# EAGLE design Adafruit bicolor 8x8 (EAGLE 6.3)
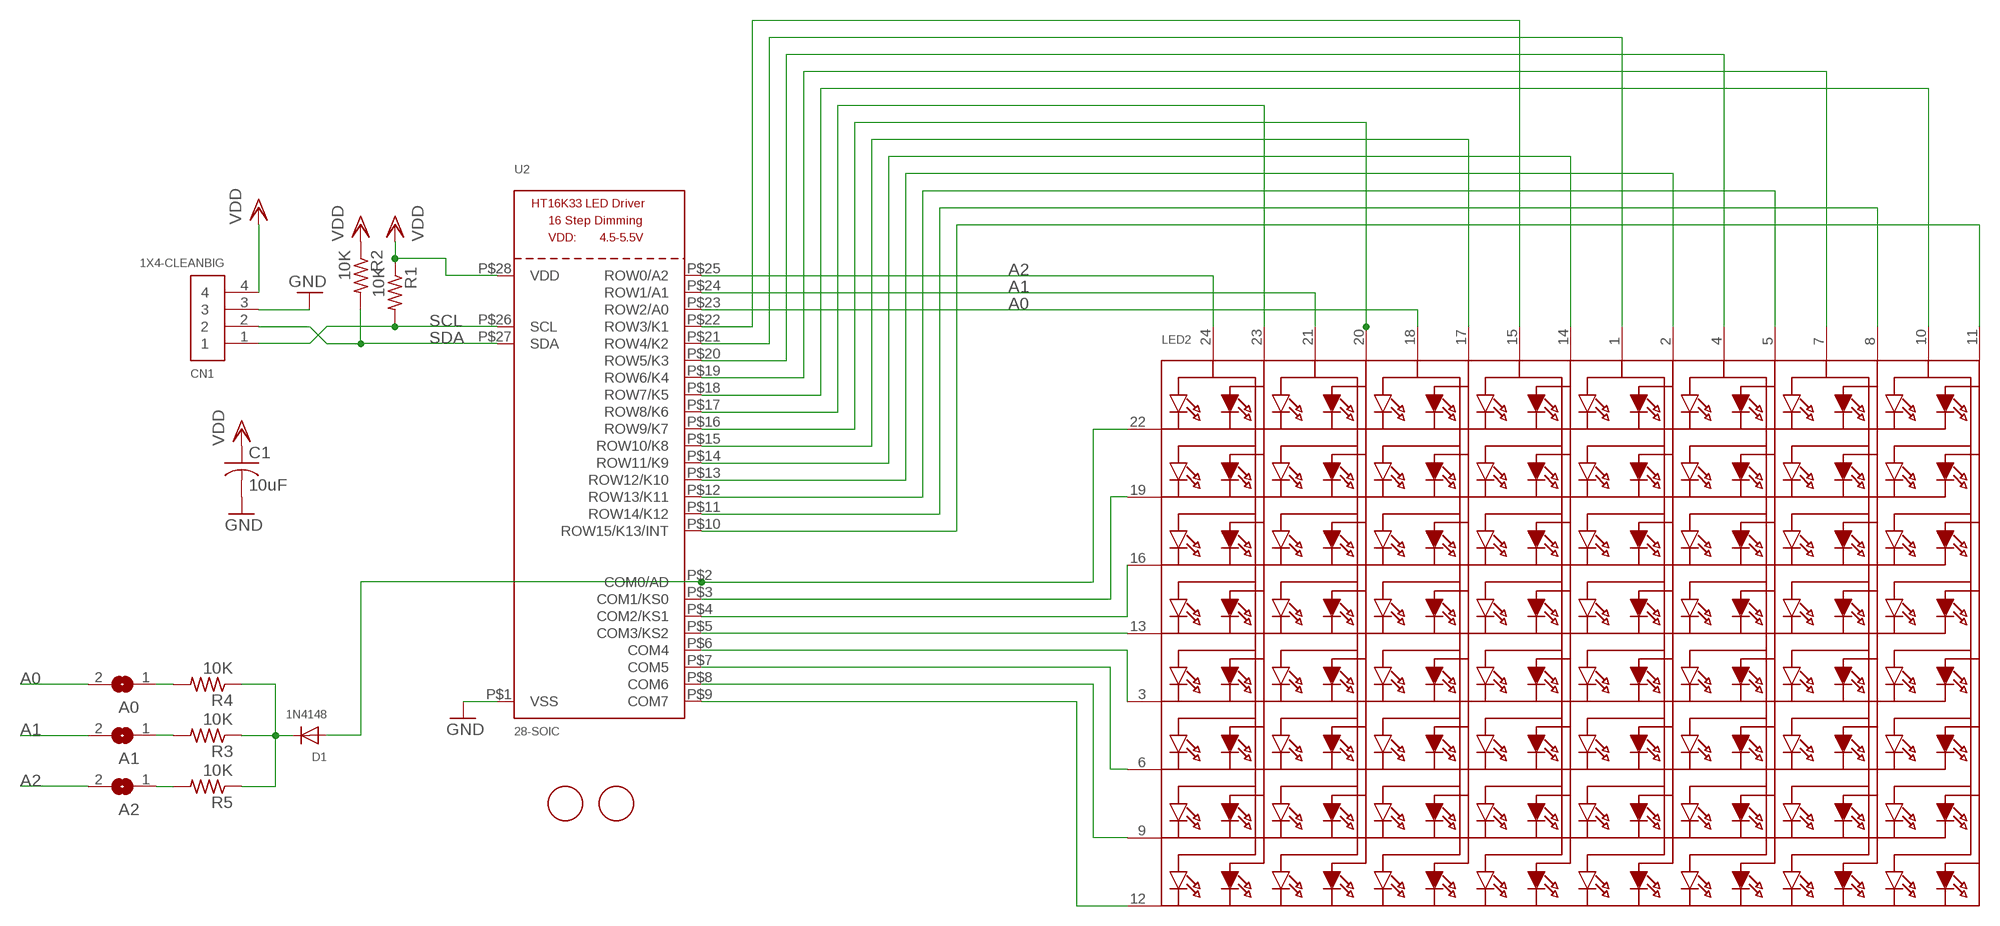
[diagram p0: schematic, sheet 1]

## Parts
A0  SOLDERJUMPERREFLOW_NOPASTE  [SOLDERJUMPER_REFLOW_NOPASTE]
A1  SOLDERJUMPERREFLOW_NOPASTE  [SOLDERJUMPER_REFLOW_NOPASTE]
A2  SOLDERJUMPERREFLOW_NOPASTE  [SOLDERJUMPER_REFLOW_NOPASTE]
C1  10uF  C-USC0805  [C0805]
CN1  1X4-CLEANBIG  [1X04-CLEANBIG]
D1  1N4148  DIODESOD-323F  [SOD-323F]
LED2  DISP_SEGMENT_8X8_BICOLOR_ROWCATHODEMI2A883XX  [SEGMENT_BICOL_BL-M12A883XX]
R1  10K  R-US_R0805  [R0805]
R2  10K  R-US_R0805  [R0805]
R3  10K  R-US_R0805  [R0805]
R4  10K  R-US_R0805  [R0805]
R5  10K  R-US_R0805  [R0805]
U2  28-SOIC  HT16K33_SOP28  [SOP28_300MIL]
U$1  FIDUCIAL  [FIDUCIAL_1MM]
U$2  FIDUCIAL  [FIDUCIAL_1MM]

## Nets
A0: A0.2 LED2.18(A5) U2.P$23(ROW2/A0)
A1: A1.2 LED2.21(A3) U2.P$24(ROW1/A1)
A2: A2.2 LED2.24(A1) U2.P$25(ROW0/A2)
GND: C1.2 CN1.3 U2.P$1(VSS)
N$1: LED2.12(K8) U2.P$9(COM7)
N$2: LED2.9(K7) U2.P$8(COM6)
N$3: LED2.6(K6) U2.P$7(COM5)
N$4: LED2.3(K5) U2.P$6(COM4)
N$5: LED2.13(K4) U2.P$5(COM3/KS2)
N$6: LED2.16(K3) U2.P$4(COM2/KS1)
N$7: LED2.19(K2) U2.P$3(COM1/KS0)
N$8: D1.A LED2.22(K1) U2.P$2(COM0/AD)
N$9: A2.1 R5.2
N$10: LED2.8(A14) U2.P$11(ROW14/K12)
N$11: LED2.5(A12) U2.P$12(ROW13/K11)
N$12: LED2.11(A16) U2.P$10(ROW15/K13/INT)
N$16: D1.C R3.1 R4.1 R5.1
N$19: A1.1 R3.2
N$20: A0.1 R4.2
N$22: LED2.10(A15) U2.P$18(ROW7/K5)
N$23: LED2.7(A13) U2.P$19(ROW6/K4)
N$25: LED2.1(A9) U2.P$21(ROW4/K2)
N$26: LED2.15(A7) U2.P$22(ROW3/K1)
N$35: LED2.4(A11) U2.P$20(ROW5/K3)
N$38: LED2.23(A2) U2.P$17(ROW8/K6)
N$39: LED2.20(A4) U2.P$16(ROW9/K7)
N$40: LED2.14(A8) U2.P$14(ROW11/K9)
N$41: LED2.17(A6) U2.P$15(ROW10/K8)
N$42: LED2.2(A10) U2.P$13(ROW12/K10)
SCL: CN1.1 R1.2 U2.P$26(SCL)
SDA: CN1.2 R2.2 U2.P$27(SDA)
VDD: C1.1 CN1.4 R1.1 R2.1 U2.P$28(VDD)

## Library data of the parts
A0 A1 A2 = microbuilder:SOLDERJUMPER: SMD Solder JUMPER Solder the two pads together to create a connection, or remove the solder to break it. REFLOW - Use this footprint for solder paste and reflow ovens. WAVE - Use this footprint for hand-soldering (larger pads). CLOSED - Has a trace between the two pads to ensure it is closed by default. The trace needs to be cut to disable the jumper, and can be closed again by creating a solder bridge between the two pads.
C1 = rcl:C-US: CAPACITOR, American symbol
CN1 = adafruit:1X4: 4-pin connector
D1 = adafruit:DIODE: Diode SMADIODE - SMA Surface Mount Package 20V 1A Schottky Diode Digikey: 641-1014-6-ND DO-1N4148 - Through Hole Small Current Diode SOD-123 20V 1 A (.5mV Vf) Schottky Diode - Digikey: MBRX120TPMSCT-ND SOD-323 10V 570mA (.38mV Vf, 3ns) Schottky Diode - Digikey: ZLLS410CT-ND SOD-523 30V 30mA Schottky Diode (RB751S-40TE61) - Digikey: RB751S-40TE61CT-ND SOT23-R/W - SOT23 Package (R = Solder Paste/Reflow Ovens, W = Hand-Soldering) BAT54Film 40V 300mA - Digikey: 497-7162-1-ND
LED2 = microbuilder:DISP_SEGMENT_8X8_BICOLOR_ROWCATHODE: 8x8 Bi-Color LED Segment Displays: Row = Cathode 1.2" Bi-Color 8x8 Matrix, 3.0mm Square LEDs - BL-M12A883XX
R1-R5 = adafruit:R-US_: RESISTOR, American symbol
U2 = microbuilder:HT16K33_SOP28
U$1 U$2 = adafruit:FIDUCIAL: For use by pick and place machines to calibrate the vision/machine, 1mm By microbuilder.eu

## Board
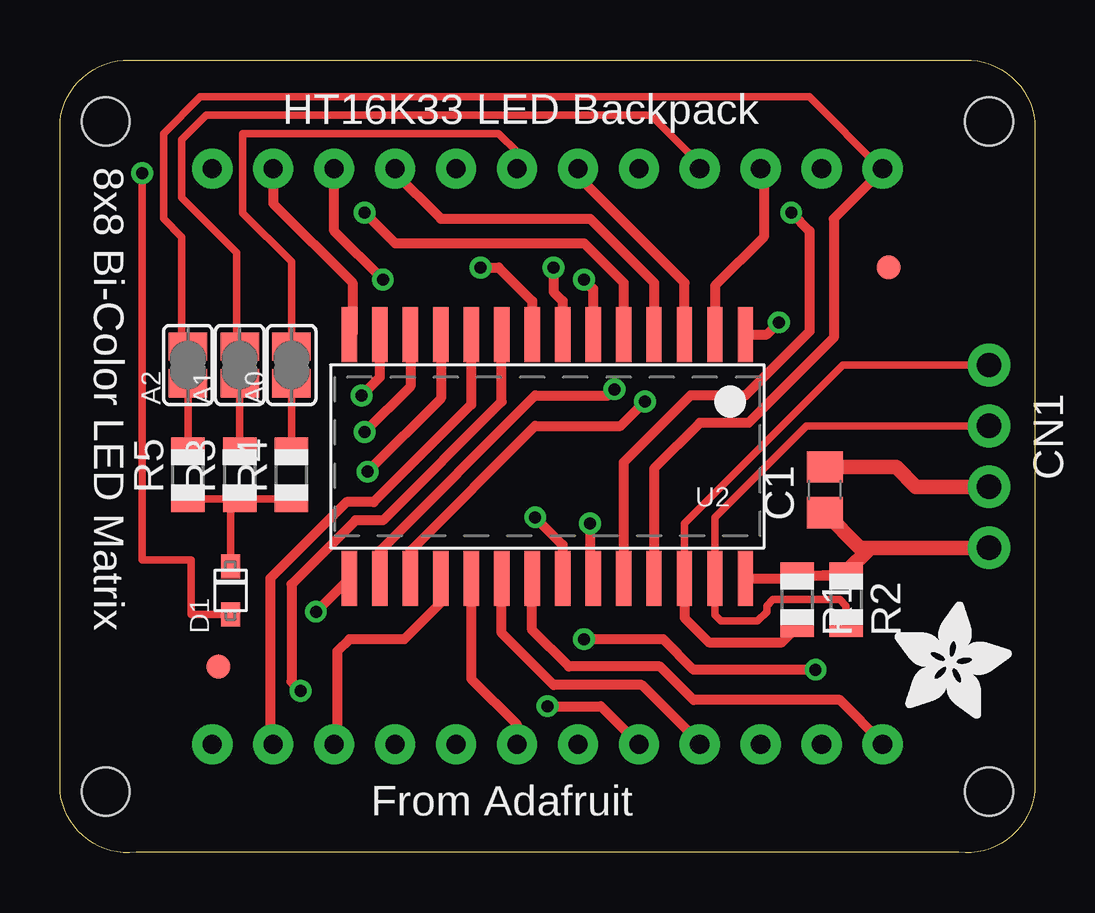
[diagram p1: board, top side]
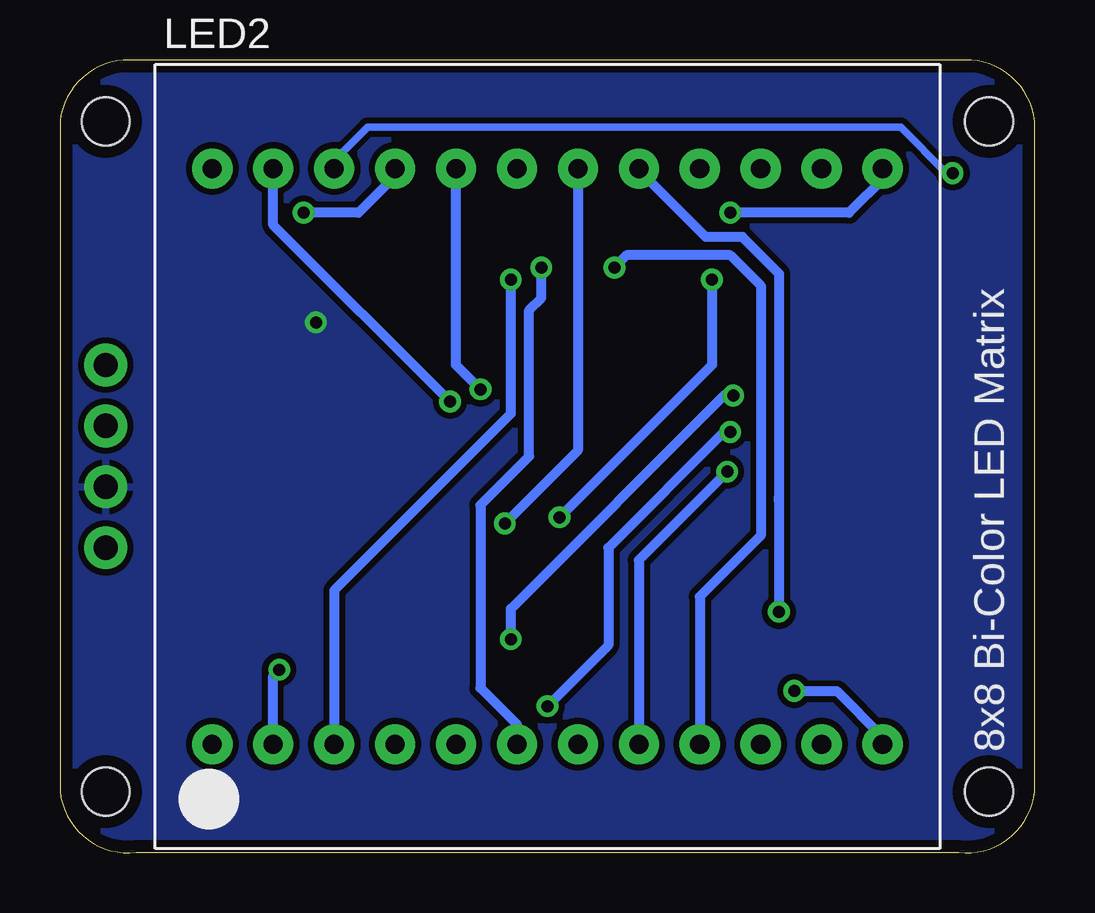
[diagram p2: board, bottom side, seen from below]

Size 40.64 x 33.05 mm. Coordinates in mm from the lower left corner, seen from the top.
Outline: 0,30.5 arc-90 3.18,33.04 37.47,33.04 arc-90 40.64,30.5 40.64,2.56 arc-90 37.47,0.02 3.18,0.02 arc-90 0,2.56 0,30.5
Copper layers (1*16): Top 0.035mm / dielectric 1.5mm / Bottom 0.035mm
Design rules: minimum track width 10mil, minimum drill 19mil, track to track 10mil, track to pad 10mil, pad to pad 10mil, via to via 10mil, smd to smd 8mil, copper to edge 20mil, drill to drill 8mil, minimum pad ring 10mil, minimum via ring 8mil, stop-mask expansion 4mil, vias tented up to drill 20mil, thermal gap 10mil
Holes 2 mm at 1.91,2.56 38.73,2.56 1.91,30.5 38.73,30.5

### Footprints (pad centres in the part's own frame; a part is rotated, then mirrored left to right if it is on the bottom)
SOLDERJUMPER_REFLOW_NOPASTE = smd 1.168 x 1.6: 1 -0.762,0; 2 0.762,0
C0805 = smd 1.3 x 1.5: 1 -0.95,0; 2 0.95,0
1X04-CLEANBIG = drill 1.016 pad 1.778: 1 -3.81,0; 2 -1.27,0; 3 1.27,0; 4 3.81,0
SOD-323F = smd 1 x 0.8: A -1,0; C 1,0
SEGMENT_BICOL_BL-M12A883XX = drill 0.8 pad 1.676: 1 -13.97,-12; 2 -11.43,-12; 3 -8.89,-12; 4 -6.35,-12; 5 -3.81,-12; 6 -1.27,-12; 7 1.27,-12; 8 3.81,-12; 9 6.35,-12; 10 8.89,-12; 11 11.43,-12; 12 13.97,-12; 13 13.97,12; 14 11.43,12; 15 8.89,12; 16 6.35,12; 17 3.81,12; 18 1.27,12; 19 -1.27,12; 20 -3.81,12; 21 -6.35,12; 22 -8.89,12; 23 -11.43,12; 24 -13.97,12
R0805 = smd 1.1 x 1.4: 1 -1,0; 2 1,0
SOP28_300MIL = smd 0.635 x 2.286: P$1 -8.255,-5.08; P$2 -6.985,-5.08; P$3 -5.715,-5.08; P$4 -4.445,-5.08; P$5 -3.175,-5.08; P$6 -1.905,-5.08; P$7 -0.635,-5.08; P$8 0.635,-5.08; P$9 1.905,-5.08; P$10 3.175,-5.08; P$11 4.445,-5.08; P$12 5.715,-5.08; P$13 6.985,-5.08; P$14 8.255,-5.08; P$15 8.255,5.08; P$16 6.985,5.08; P$17 5.715,5.08; P$18 4.445,5.08; P$19 3.175,5.08; P$20 1.905,5.08; P$21 0.635,5.08; P$22 -0.635,5.08; P$23 -1.905,5.08; P$24 -3.175,5.08; P$25 -4.445,5.08; P$26 -5.715,5.08; P$27 -6.985,5.08; P$28 -8.255,5.08
FIDUCIAL_1MM = smd 1 x 1: 1 0,0

### Placement (x,y rotation side)
A0  9.65,20.34 90 top
A1  7.49,20.34 90 top
A2  5.33,20.34 90 top
C1  31.88,15.13 90 top
CN1  38.73,16.53 270 top
D1  7.11,10.94 90 top
LED2  20.32,16.53 0 bottom
R1  30.73,10.56 270 top
R2  32.77,10.56 270 top
R3  7.49,15.77 90 top
R4  9.65,15.77 90 top
R5  5.33,15.77 90 top
U2  20.32,16.53 180 top
U$1  34.54,24.4 0 top
U$2  6.6,7.76 0 top
U$3  [ADAFRUIT_5MM]  34.8,5.61 0 top

### Tracks (layer width: path | path; a pad name or v marks a point on that pad's centre or on a via)
A0  (via drill 0.5)
  Top 0.305: 19.05,28.47 LED2.18 19.05,29.23 18.29,29.99 7.62,29.99 7.62,26.67 9.65,24.64 A0.2
  Top 0.406: U2.P$23 22.35,11.45 22.1,11.7 v22.1,13.73
  Bottom 0.406: LED2.18 19.05,16.78 v22.1,13.73
A1  (via drill 0.5)
  Top 0.305: LED2.21 26.67,28.72 24.64,30.75 6.1,30.75 5.08,29.74 5.08,27.31 7.37,25.02 7.37,21.1 A1.2
  Top 0.406: U2.P$24 23.5,16.27 26.29,19.07 28.58,19.07 31.24,21.73 31.24,25.93 v30.48,26.69
  Bottom 0.406: 26.54,28.47 26.61,28.47 LED2.21 26.48,28.53 26.42,28.47 28.19,26.69 v30.48,26.69
A2
  Top 0.305: 34.29,28.47 31.24,31.51 5.84,31.51 4.32,29.99 4.32,26.43 5.08,25.67 5.08,21.1 A2.2
  Top 0.406: U2.P$25 24.77,16.02 26.67,17.92 28.7,17.92 32.26,21.48 32.26,26.43 34.29,28.47 LED2.24
GND  (via drill 0.5)
  Top 0.406: U2.P$1 29.46,21.61 v29.97,22.12
  Top 0.61: C1.2 34.86,16.08 35.69,15.26 CN1.3
  pour Bottom: -0.63,33.04 40.89,33.04 40.89,0.02 -0.63,0.02
N$1  (via drill 0.5)
  Top 0.406: U2.P$9 18.41,18.81 13.46,13.86 12.32,13.86 9.65,11.19 9.65,7.13 v10.03,6.75
  Bottom 0.406: LED2.12 6.35,4.84 8.26,6.75 v10.03,6.75
N$2  (via drill 0.5)
  Top 0.406: U2.P$8 19.68,23 18.29,24.4 v17.53,24.4
  Bottom 0.406: LED2.9 13.97,10.69 11.43,13.23 11.43,23.64 12.7,24.91 17.02,24.91 v17.53,24.4
N$3  (via drill 0.5)
  Top 0.406: U2.P$7 20.96,23 20.57,23.39 v20.57,24.4
  Bottom 0.406: v20.57,24.4 20.57,23.13 21.08,22.62 21.08,16.53 23.11,14.5 23.11,6.88 21.59,5.35 LED2.6
N$4  (via drill 0.5)
  Top 0.406: U2.P$6 22.23,23.51 v21.84,23.89
  Bottom 0.406: v21.84,23.89 21.84,18.31 29.21,10.94 LED2.3
N$5  (via drill 0.5)
  Top 0.406: U2.P$5 23.5,23.77 21.84,25.42 13.97,25.42 v12.7,26.69
  Bottom 0.406: LED2.13 6.35,28.34 6.22,28.21 7.75,26.69 v12.7,26.69
N$6
  Top 0.406: U2.P$4 24.77,23.77 22.1,26.43 15.88,26.43 13.84,28.47 13.91,28.53 LED2.16
N$7
  Top 0.406: U2.P$3 26.04,23.77 21.59,28.21 LED2.19 21.59,28.59
N$8  (via drill 0.5)
  Top 0.305: D1.A 5.46,9.94 5.46,12.21 3.43,12.21 v3.43,28.34
  Top 0.406: U2.P$2 27.3,23.64 29.34,25.67 29.34,28.47 29.27,28.47 LED2.22
  Bottom 0.305: v3.43,28.34 3.68,28.34 5.59,30.24 27.81,30.24 29.21,28.85 LED2.22
N$9
  Top 0.305: A2.1 R5.2
N$10  (via drill 0.5)
  Top 0.406: U2.P$11 15.88,18.94 v12.83,15.89
  Bottom 0.406: v12.83,15.89 16.51,12.21 LED2.8
N$11  (via drill 0.5)
  Top 0.406: U2.P$12 14.61,19.45 v12.7,17.54 | LED2.5 22.54,6.11 v20.32,6.11
  Bottom 0.406: v20.32,6.11 17.78,8.65 17.78,12.72 12.95,17.54 v12.7,17.54
N$12
  Top 0.406: U2.P$10 17.14,18.69 13.08,14.62 11.94,14.62 8.76,11.45 8.76,4.65 LED2.11
N$16
  Top 0.305: 7.48,14.75 7.37,14.75 | R4.1 9.64,14.75 7.62,14.75 | 7.62,14.75 7.48,14.75 | 5.32,14.75 5.21,14.75 | 5.32,14.75 R5.1 | 7.48,14.75 R3.1 7.6,14.77 7.62,14.75 | 7.48,14.75 5.32,14.75 | D1.C 7.11,14.24 7.62,14.75
N$19
  Top 0.305: 7.49,16.65 R3.2 A1.1
N$20
  Top 0.305: A0.1 R4.2
N$22
  Top 0.406: U2.P$18 15.88,10.43 14.35,8.91 12.06,8.91 11.56,8.4 11.56,4.46 11.49,4.53 LED2.10
N$23
  Top 0.406: U2.P$19 17.14,7.26 19.05,5.35 19.05,4.72 19.18,4.59 19.12,4.53 LED2.7
N$25
  Top 0.406: U2.P$21 19.68,9.29 21.21,7.76 25.02,7.76 26.42,6.37 32.51,6.37 34.29,4.59 | 34.29,4.59 34.29,4.84 | 34.29,4.59 LED2.1
N$26  (via drill 0.5)
  Top 0.406: U2.P$22 20.96,12.84 v19.81,13.99 | v13.46,23.89 11.43,25.93 LED2.15
  Bottom 0.406: v19.81,13.99 13.46,20.34 v13.46,23.89
N$35
  Top 0.406: U2.P$20 18.41,9.16 20.57,7 24.26,7 26.67,4.59 LED2.4
N$38  (via drill 0.5)
  Top 0.406: U2.P$17 14.61,12.59 19.81,17.8 23.37,17.8 v24.38,18.81
  Bottom 0.406: v24.38,18.81 31.75,26.18 LED2.23
N$39  (via drill 0.5)
  Top 0.406: U2.P$16 13.34,12.59 19.81,19.07 22.86,19.07 v23.11,19.32
  Bottom 0.406: v23.11,19.32 24.13,20.34 LED2.20
N$40
  Top 0.406: LED2.14 8.89,27.07 12.19,23.77 12.19,21.61 U2.P$14
N$41  (via drill 0.5)
  Top 0.406: v10.67,10.05 U2.P$15
  Bottom 0.406: 10.67,14.62 v10.67,10.05 | 10.67,14.62 10.67,14.88 | 10.67,14.62 10.67,24.15 12.19,25.67 13.72,25.67 16.51,28.47 LED2.17
N$42  (via drill 0.5)
  Top 0.406: U2.P$13 13.34,19.83 v12.57,19.07 | v31.5,7.64 26.42,7.64 25.15,8.91 v21.84,8.91
  Bottom 0.406: 31.88,4.72 32,4.59 31.94,4.53 LED2.2 31.75,7.38 v31.5,7.64 | v12.57,19.07 12.95,19.07 21.84,10.18 v21.84,8.91
SCL
  Top 0.305: CN1.1 32.64,20.34 26.04,13.73 U2.P$26
  Top 0.406: U2.P$26 26.04,9.8 27.05,8.78 30.1,8.78 30.73,9.42 R1.2
SDA
  Top 0.305: 32.77,9.54 R2.2 32.77,10.3 32.51,10.56 29.72,10.56 29.46,10.3 29.46,10.05 29.08,9.67 27.56,9.67 27.3,9.92 U2.P$27 27.3,13.99 31.12,17.8 CN1.2
VDD
  Top 0.406: U2.P$28 30.73,11.45 R1.1 32.62,11.56 32.77,11.7 R2.1 31.75,11.56
  Top 0.61: 32.77,11.7 33.78,12.72 33.91,12.72 | 33.91,12.72 CN1.4 | C1.1 33.34,12.72 33.91,12.72

### Text on the board
tPlace: HT16K33 LED Backpack | 8x8 Bi-Color LED Matrix | From Adafruit
bPlace: 8x8 Bi-Color LED Matrix
tDocu: SCL | SDA | GND | VCC | A2 | A1 | A0
bDocu: C | D | - | +